# Altium schematic sheet BlueBox-Amp [PowerSuply].SchDoc
size A
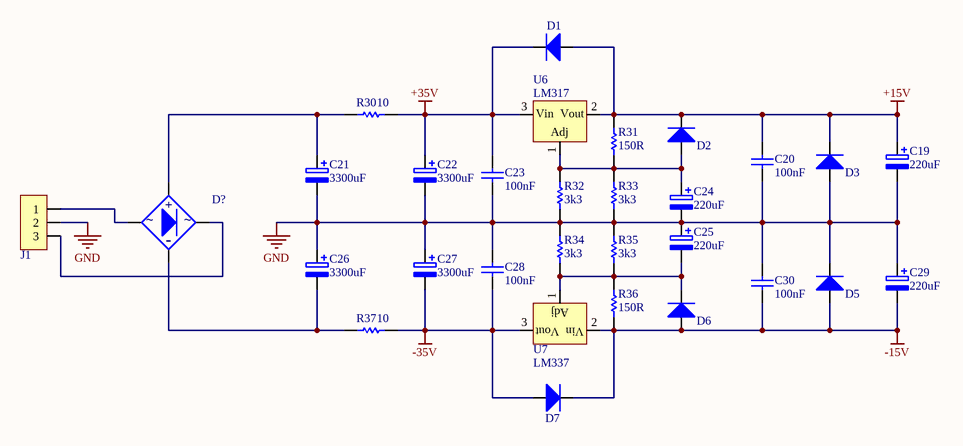
[diagram p0: BlueBox-Amp [PowerSuply].SchDoc]

## Parts
C19  value 220uF  [E5-10,5]  (hidden comment: Capacitor Polarized)
C20  value 100nF  [CAPC0603(1608)100_L]  (hidden comment: CAP 100nF 50V 0603(1608))
C21  value 3300uF  [EC P7.5-D18-H35.5]  (hidden comment: Capacitor Polarized)
C22  value 3300uF  [EC P7.5-D18-H35.5]  (hidden comment: Capacitor Polarized)
C23  value 100nF  [CAPC0603(1608)100_L]  (hidden comment: CAP 100nF 50V 0603(1608))
C24  value 220uF  [E5-10,5]  (hidden comment: Capacitor Polarized)
C25  value 220uF  [E5-10,5]  (hidden comment: Capacitor Polarized)
C26  value 3300uF  [EC P7.5-D18-H35.5]  (hidden comment: Capacitor Polarized)
C27  value 3300uF  [EC P7.5-D18-H35.5]  (hidden comment: Capacitor Polarized)
C28  value 100nF  [CAPC0603(1608)100_L]  (hidden comment: CAP 100nF 50V 0603(1608))
C29  value 220uF  [E5-10,5]  (hidden comment: Capacitor Polarized)
C30  value 100nF  [CAPC0603(1608)100_L]  (hidden comment: CAP 100nF 50V 0603(1608))
D1  STTH1R02A  [SMA]  (value not drawn)
D2  STTH1R02A  [SMA]  (value not drawn)
D3  STTH1R02A  [SMA]  (value not drawn)
D5  STTH1R02A  [SMA]  (value not drawn)
D6  STTH1R02A  [SMA]  (value not drawn)
D7  STTH1R02A  [SMA]  (value not drawn)
D?  KBU1010  [KBU1010]  (value not drawn)
J1  Header 3X1  [HDR1X3]  (value not drawn)
R30  value 10  [RESC2512(6432)_L]  (hidden comment: 10R 5% 2512(6432))
R31  value 150R  [RESC0603(1608)_M]  (hidden comment: 150R 1% 0603(1608))
R32  value 3k3  [RESC0603(1608)_L]  (hidden comment: 3K3 1% 0603(1608))
R33  value 3k3  [RESC0603(1608)_L]  (hidden comment: 3K3 1% 0603(1608))
R34  value 3k3  [RESC0603(1608)_L]  (hidden comment: 3K3 1% 0603(1608))
R35  value 3k3  [RESC0603(1608)_L]  (hidden comment: 3K3 1% 0603(1608))
R36  value 150R  [RESC0603(1608)_M]  (hidden comment: 150R 1% 0603(1608))
R37  value 10  [RESC2512(6432)_L]  (hidden comment: 10R 5% 2512(6432))
U6  LM317  [D2-PAK-3]
U7  LM337  [D2-PAK-3]

## Nets
+15V: C19.1 C20.2 D1.1(A) D2.2(K) D3.2(K) R31.2 U6.2(OUT)
+35V: C22.1 C23.2 D1.2(K) R30.2 U6.3(IN)
-15V: C29.2 C30.1 D5.1(A) D6.1(A) D7.2(K) R36.1 U7.2(IN)
-35V: C27.2 C28.1 D7.1(A) R37.2 U7.3(OUT)
GND: C19.2 C20.1 C21.2 C22.2 C23.1 C24.2 C25.1 C26.1 C27.1 C28.2 C29.1 C30.2 D3.1(A) D5.2(K) J1.2 R32.1 R33.1 R34.2 R35.2
NetC21_1: C21.1 D?.1(+) R30.1
NetC24_1: C24.1 D2.1(A) R31.1 R32.2 R33.2 U6.1(Adj)
NetC25_2: C25.2 D6.2(K) R34.1 R35.1 R36.2 U7.1(Adj)
NetC26_2: C26.2 D?.4(-) R37.1
NetD?_2: D?.2(s1) J1.1
NetD?_3: D?.3(s2) J1.3

## Notes on the sheet
- (in symbol KBU1010) ~
- (in symbol LM317D2TR4G) Vin; Vout
- (in symbol LM337D2TR4G) Vout; Vin

## Library data of the parts
C19 C21 C22 C24-C27 C29 = Capacitor Polarized: Polarized Capacitor
C20 C23 C28 C30 = CMP-1035-02591-1: CAP 100nF 50V ±5% 0603 (1608 Metric) Thickness 1mm SMD; Case-Metric: 1608; Case-EIA: 0603; Rated Voltage: 50 V; Max Thickness: 1 mm; Tolerance: ±5%; Technology: SMT
D1-D3 D5-D7 = STTH1R02A: Rectifiers Ultrafast recovery Diode; Manufacturer: Taiwan Semiconductor; Manufacturer Part Number: RS2BA; Configuration: Single; Forward Continuous Current: 1.5 A; Max Surge Current: 50 A; Recovery Time: 150 ns; Reverse Voltage: 100 V; Forward Voltage Drop: 1.3 V; Reverse Current IR: 5 uA; Value: *; RoHS: RoHS Compliant By Exemption; Category: Rectifiers; Package / Case: DO-214AC-2; Packaging: Reel; Product: Fast Recovery Rectifiers; Brand: Taiwan Semiconductor; Mounting Style: SMD/SMT; Maximum Operating Temperature: + 150 C; Minimum Operating Temperature: - 55 C; Product Category: Rectifiers - Fast Recovery; Standard Pack Qty: 7500; RoHS - Mouser: E; Minimum Order Quantity: 1; Reeling: True; ComponentLink1URL: http://www.mouser.com/ds/2/395/RS2AA SERIES_G14-523440.pdf; ComponentLink1Description: http://www.mouser.com/ds/2/395/RS2AA SERIES_G14-523440.pdf; Series: STTH1R02; ComponentLink2URL: http://www.mouser.com/ds/2/389/CD00110329-250796.pdf; ComponentLink2Description: http://www.mouser.com/ds/2/389/CD00110329-250796.pdf; Supplier 1: Mouser; Supplier Part Number 1: 821-RS2BA; Stock 1: 0; Pricing 1: 1=0.297, 25=0.267, 100=0.178, 500=0.137, 1000=0.101, 1800=0.091, 3600=0.088, 9000=0.074 (AUD); Supplier 2: Mouser; Supplier Part Number 2: 511-STTH1R02A; Stock 2: 13423; Pricing 2: 1=0.668, 10=0.447, 100=0.249, 1000=0.187, 5000=0.157, 10000=0.146, 25000=0.134, 50000=0.129, 100000=0.123 (AUD)
D? = KBU1010: Manufacturer: Comchip Technology; Manufacturer Part Number: KBU1010-G; Value: DF01S1; Forward Continuous Current: 10 A; Max Surge Current: 240 A; Forward Voltage Drop: 1 V; Maximum Reverse Leakage Current: 10 uA; Maximum RMS Reverse Voltage: 700 V; Peak Reverse Voltage: 1000 V; RoHS: RoHS Compliant; Category: Bridge Rectifiers; Package / Case: KBU; Packaging: Bulk; Series: KBU1010; Brand: Comchip Technology; Mounting Style: Through Hole; Maximum Operating Temperature: + 125 C; Minimum Operating Temperature: - 55 C; Product Category: Comchip Technology; Standard Pack Qty: 2400; RoHS - Mouser: Y; Minimum Order Quantity: 1; Reeling: False; ComponentLink1URL: http://www.mouser.com/ds/2/80/KBU10005-G_KBU1010-G-3822.pdf; ComponentLink1Description: http://www.mouser.com/ds/2/80/KBU10005-G_KBU1010-G-3822.pdf; Supplier 1: Mouser; Supplier Part Number 1: 750-KBU1010-G; Stock 1: 80; Pricing 1: 1=2.49, 10=1.99, 100=1.47, 500=1.35, 1000=0.998, 2500=0.947, 5000=0.927, 10000=0.891 (AUD)
J1 = Header 3X1: Header, 3-Pin, Single row
R30 R37 = CMP-1018-00026-1: 10R 1W 5% 2512 (6432 Metric)  SMD; Case-EIA: 2512; Case-Metric: 6432; Power: 1 W; Technology: SMT; Tolerance: 5 %
R31 R36 = CMP-1012-00415-1: 150R 0.1W 1% 0603 (1608 Metric)  SMD; Case-Metric: 1608; Case-EIA: 0603; Tolerance: 1 %; Power: 0.1 W; Technology: SMT
R32-R35 = CMP-1012-00567-1: 3K3 0.1W 1% 0603 (1608 Metric)  SMD; Case-Metric: 1608; Case-EIA: 0603; Power: 0.1 W; Tolerance: 1 %; Technology: SMT
U6 = LM317D2TR4G: Linear Voltage Regulators 1.5A ADJ 1.2-37V Positive; Supplier 1: Mouser; Supplier Part Number 1: 863-LM317D2TR4G
U7 = LM337D2TR4G: Linear Voltage Regulators 1.5A -1.2 to -37V ADJ Negative; Supplier 1: Mouser; Supplier Part Number 1: 863-LM337D2TR4G